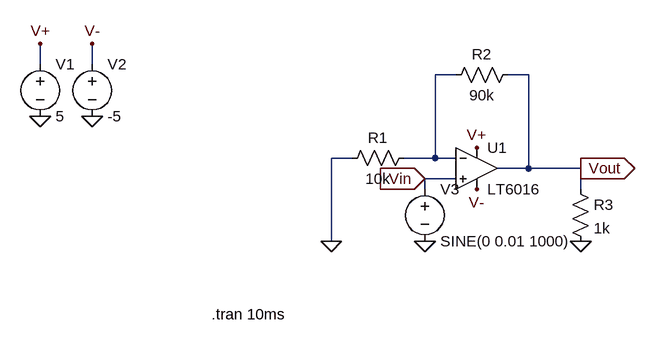
[diagram p0: schematic 5.2.asc]
5.2.asc, the LTspice schematic file:
Version 4.1
SHEET 1 880 680
WIRE -80 -16 -80 -48
WIRE 0 -16 0 -48
WIRE 560 0 528 0
WIRE 672 0 640 0
WIRE 400 128 368 128
WIRE 528 128 528 0
WIRE 528 128 480 128
WIRE 560 128 528 128
WIRE 672 144 672 0
WIRE 672 144 624 144
WIRE 752 144 672 144
WIRE 560 160 512 160
WIRE 512 176 512 160
WIRE 752 176 752 144
WIRE 368 256 368 128
FLAG -80 64 0
FLAG 0 64 0
FLAG -80 -48 V+
FLAG 0 -48 V-
FLAG 368 256 0
FLAG 512 256 0
FLAG 752 256 0
FLAG 592 176 V-
FLAG 592 112 V+
FLAG 752 144 Vout
IOPIN 752 144 Out
FLAG 512 160 Vin
IOPIN 512 160 In
SYMBOL voltage -80 -32 R0
WINDOW 123 0 0 Left 0
WINDOW 39 0 0 Left 0
SYMATTR InstName V1
SYMATTR Value 5
SYMBOL voltage 0 -32 R0
WINDOW 123 0 0 Left 0
WINDOW 39 0 0 Left 0
SYMATTR InstName V2
SYMATTR Value -5
SYMBOL OpAmps\\LT6016 592 144 R0
SYMATTR InstName U1
SYMBOL res 496 112 R90
WINDOW 0 0 56 VBottom 2
WINDOW 3 32 56 VTop 2
SYMATTR InstName R1
SYMATTR Value 10k
SYMBOL res 656 -16 R90
WINDOW 0 0 56 VBottom 2
WINDOW 3 32 56 VTop 2
SYMATTR InstName R2
SYMATTR Value 90k
SYMBOL res 736 160 R0
SYMATTR InstName R3
SYMATTR Value 1k
SYMBOL voltage 512 160 R0
WINDOW 123 0 0 Left 0
WINDOW 39 0 0 Left 0
SYMATTR InstName V3
SYMATTR Value SINE(0 0.01 1000)
TEXT 184 368 Left 2 !.tran 10ms

The netlist it stands for:
* 5.2.asc
V1 V+ 0 5
V2 V- 0 -5
* U1: LT6016 (symbol OpAmps\LT6016 not available, pins judged from their places): In+=Vin In-=N001 V+=V+ V-=V- OUT=Vout
R1 N001 0 10k
R2 Vout N001 90k
R3 Vout 0 1k
V3 Vin 0 SINE(0 0.01 1000)
.tran 10ms
.backanno
.end